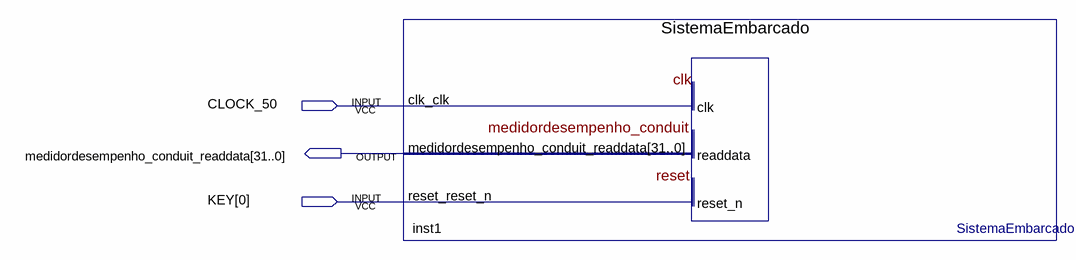
[diagram p0: schematic sheet]
// Quartus schematic RansacNios.bdf as structural Verilog: 1 symbols, 3 pins
module RansacNios (
  input  CLOCK_50,
  input  [0:0] KEY,
  output [31:0] medidordesempenho_conduit_readdata
);

  SistemaEmbarcado inst1 (
    .clk_clk(CLOCK_50), .reset_reset_n(KEY[0]),
    .medidordesempenho_conduit_readdata(medidordesempenho_conduit_readdata));
endmodule
